# Altium schematic sheet Sheet1.SchDoc
size A; SheetNumber: 1; SheetTotal: 1
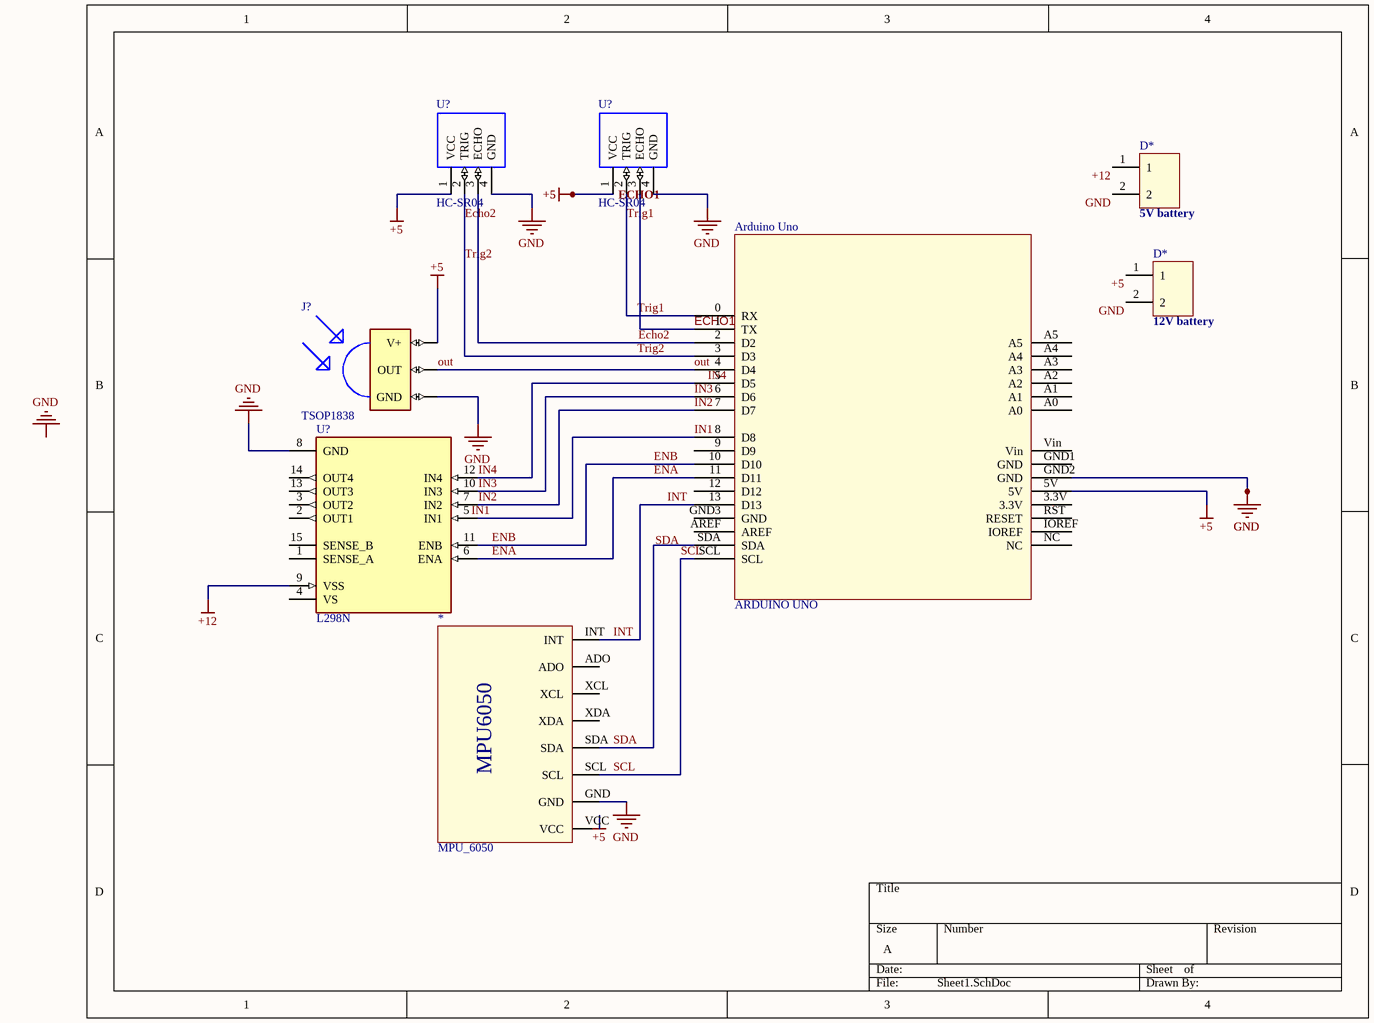
[diagram p0: Sheet1.SchDoc]

## Parts
(Parts that share a designator on the sheet are numbered #1, #2 ... from top to bottom, then left to right.)
*  MPU_6050  [MPU6050]
Arduino_Uno  ARDUINO UNO  [ARDUINO UNO]
D*#1  5V battery  [DATA_PIN_HEADER_2_2.54m]
D*#2  12V battery  [DATA_PIN_HEADER_2_2.54m]
J?  TSOP1838  [TSOP18XX]
U?#1  HC-SR04  [XCVR_HC-SR04]
U?#2  HC-SR04  [XCVR_HC-SR04]
U?#3  L298N  [TO127P2020X500X2100-15]

## Nets
+5: *.VCC Arduino_Uno.5V D*#2.1 J?.VCC(V+) U?#1.1(VCC) U?#2.1(VCC)
+12: D*#1.1 U?#3.9(VSS)
GND: *.GND Arduino_Uno.GND2(GND) D*#1.2 D*#2.2 J?.GND U?#1.4(GND) U?#2.4(GND) U?#3.8(GND)
ECHO1: Arduino_Uno.1(TX) U?#2.3(ECHO)
Echo2: Arduino_Uno.2(D2) Arduino_Uno.3(D3) U?#1.2(TRIG) U?#1.3(ECHO)  [also labelled Trig2]
ENA: Arduino_Uno.11(D11) U?#3.6(ENA)
ENB: Arduino_Uno.10(D10) U?#3.11(ENB)
IN1: Arduino_Uno.8(D8) U?#3.5(IN1)
IN2: Arduino_Uno.7(D7) U?#3.7(IN2)
IN3: Arduino_Uno.6(D6) U?#3.10(IN3)
IN4: Arduino_Uno.5(D5) U?#3.12(IN4)
INT: *.INT Arduino_Uno.13(D13)
out: Arduino_Uno.4(D4) J?.OUT
SCL: *.SCL Arduino_Uno.SCL
SDA: *.SDA Arduino_Uno.SDA
Trig1: Arduino_Uno.0(RX) U?#2.2(TRIG)

Not connected (* = marked no-connect by the designer): * ADO XCL XDA; Arduino_Uno 3.3V 9(D9) 12(D12) A0 A1 A2 A3 A4 A5 AREF GND1(GND) GND3(GND) IOREF NC RST(RESET) Vin; U?#3 1(SENSE_A) 2(OUT1) 3(OUT2) 4(VS) 13(OUT3) 14(OUT4) 15(SENSE_B)

## Notes on the sheet
- Labels drawn without touching a wire or pin: GND, IN4, SDA
- (in symbol MPU_6050) MPU6050

## Library data of the parts
D*#1 D*#2 = DATA_PIN_HEADER_2_2.54m
J? = TSOP1838: IR Receiver and Demodulator; Value: *; MP: TSOP1838; Package: None; Availability: Unavailable; Price: None
U?#1 U?#2 = HC-SR04: Ultrasonic Sensor Module; Availability: Unavailable; MP: HC-SR04; Value: *; Price: None; Package: None
U?#3 = L298N: Dual Full Bridge Motor Driver 15-Pin(15+Tab) MULTIWATT V Tube; MP: L298N; Availability: Unavailable; Package: None; Value: *; Price: None